# Altium schematic sheet CANDLE-01.SchDoc
size 297 x 209 mm; SheetNumber: 1; SheetTotal: 3
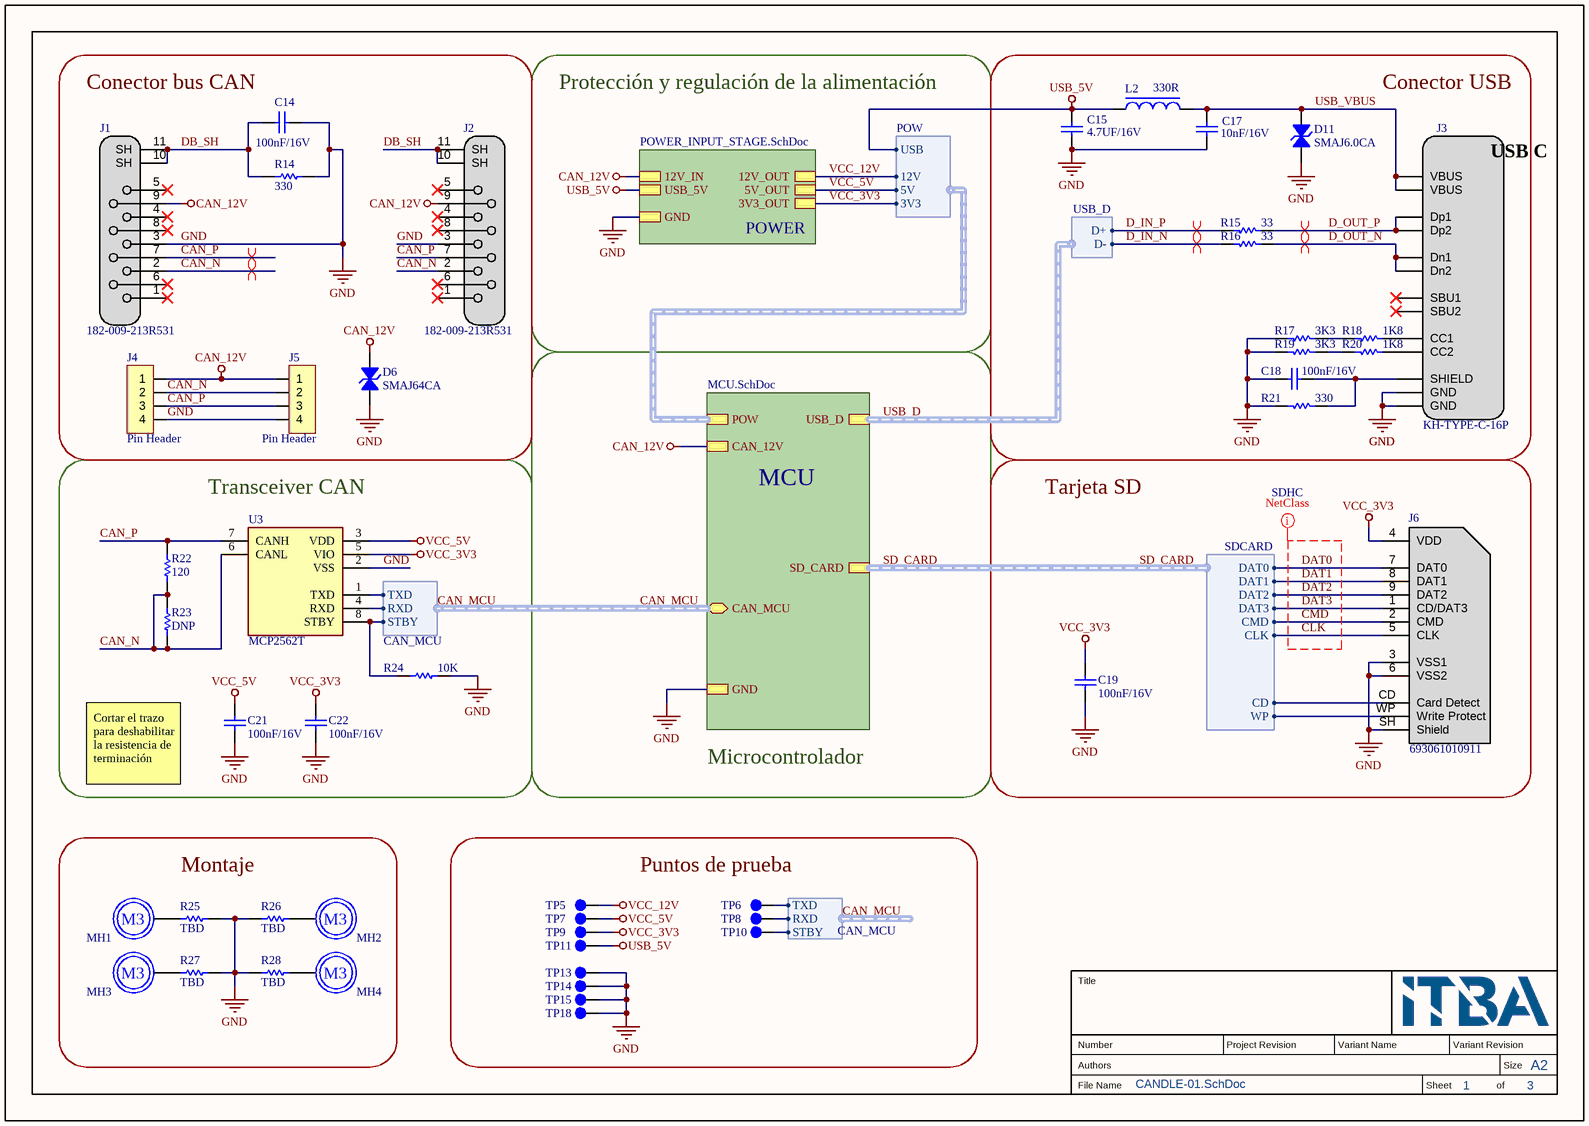
[diagram p0: CANDLE-01.SchDoc]

## Parts
C14  100nF/16V  [CAP0805]
C15  4.7UF/16V  [CAP0805]
C17  10nF/16V  [CAP0805]
C18  100nF/16V  [CAP0805]
C19  100nF/16V  [CAP0805]
C21  100nF/16V  [CAP0805]
C22  100nF/16V  [CAP0805]
D6  SMAJ64CA  [DO-214AC]
D11  SMAJ6.0CA  [DO-214AC]
J1  182-009-213R531  [DE-9 - Female]
J2  182-009-213R531  [DE-9 - Female]
J3  KH-TYPE-C-16P  [USB4105-GF-A-060]
J4  Pin Header  [HEADER-4]
J5  Pin Header  [HEADER-4]
J6  693061010911  [SD CARD CONNECTOR]
L2  330R  [RES0805]
MH1  M3 Mount Hole  [M3_MOUNTING_HOLE]  (value not drawn)  (no BOM)
MH2  M3 Mount Hole  [M3_MOUNTING_HOLE]  (value not drawn)  (no BOM)
MH3  M3 Mount Hole  [M3_MOUNTING_HOLE]  (value not drawn)  (no BOM)
MH4  M3 Mount Hole  [M3_MOUNTING_HOLE]  (value not drawn)  (no BOM)
R14  330  [RES0805]
R15  33  [RES0805]
R16  33  [RES0805]
R17  3K3  [RES0805]
R18  1K8  [RES0805]
R19  3K3  [RES0805]
R20  1K8  [RES0805]
R21  330  [RES0805]
R22  120  [RES0805]
R23  DNP  [RES0805]  (no BOM)
R24  10K  [RES0805]
R25  TBD  [RES0805]
R26  TBD  [RES0805]
R27  TBD  [RES0805]
R28  TBD  [RES0805]
TP5  Testpoint  [TP_SMD_Ø1.0mm]  (value not drawn)  (no BOM)
TP6  Testpoint  [TP_SMD_Ø1.0mm]  (value not drawn)  (no BOM)
TP7  Testpoint  [TP_SMD_Ø1.0mm]  (value not drawn)  (no BOM)
TP8  Testpoint  [TP_SMD_Ø1.0mm]  (value not drawn)  (no BOM)
TP9  Testpoint  [TP_SMD_Ø1.0mm]  (value not drawn)  (no BOM)
TP10  Testpoint  [TP_SMD_Ø1.0mm]  (value not drawn)  (no BOM)
TP11  Testpoint  [TP_SMD_Ø1.0mm]  (value not drawn)  (no BOM)
TP13  Testpoint  [TP_SMD_Ø1.0mm]  (value not drawn)  (no BOM)
TP14  Testpoint  [TP_SMD_Ø1.0mm]  (value not drawn)  (no BOM)
TP15  Testpoint  [TP_SMD_Ø1.0mm]  (value not drawn)  (no BOM)
TP18  Testpoint  [TP_SMD_Ø1.0mm]  (value not drawn)  (no BOM)
U3  MCP2562T  [8-SOIC]

## Blocks framed on the sheet
Conector bus CAN: C14 D6 J1 J2 J4 J5 R14
Conector USB: C15 C17 C18 D11 J3 L2 R15-R21
Transceiver CAN: C21 C22 R22-R24 U3
Tarjeta SD: C19 J6
Montaje: MH1-MH4 R25-R28
Puntos de prueba: TP5-TP11 TP13-TP15 TP18

## Sub-sheets
MCU = MCU.SchDoc: USB_D (harness USB_D), SD_CARD (harness SDCARD), CAN_MCU (bidir, harness CAN_MCU), POW (harness POW), CAN_12V, GND
POWER = POWER_INPUT_STAGE.SchDoc: 12V_IN, GND, 12V_OUT, 5V_OUT, 3V3_OUT, USB_5V

## Harnesses
SDCARD: DAT0, DAT1, DAT2, DAT3, CMD, CLK, CD, WP
CAN_MCU: TXD, RXD, STBY
USB_D: D+, D-
POW: 12V, 5V, 3V3, USB

## Nets
CAN_12V: D6.2(A2) J1.9 J2.9 J4.1 J5.1 ; sheet POWER/12V_IN, sheet MCU/CAN_12V
GND: C14.2 C15.1 C17.1 C18.2 C19.1 C21.1 C22.1 D6.1(A1) D11.1(A1) J1.3 J2.3 J3.A1B12(GND) J3.B1A12(GND) J4.4 J5.4 J6.3(VSS1) J6.6(VSS2) J6.SH(Shield) R14.2 R17.1 R19.1 R21.2 R24.1 R25.1 R26.2 R27.1 R28.2 TP13.1(TP) TP14.1(TP) TP15.1(TP) TP18.1(TP) U3.2(VSS) ; sheet POWER/GND, sheet MCU/GND
USB_5V: C15.2 L2.1 TP11.1(TP) ; sheet POWER/USB_5V, sheet MCU/POW.USB
VCC_3V3: C19.2 C22.2 J6.4(VDD) TP9.1(TP) U3.5(VIO) ; sheet POWER/3V3_OUT, sheet MCU/POW.3V3
VCC_5V: C21.2 TP7.1(TP) U3.3(VDD) ; sheet POWER/5V_OUT, sheet MCU/POW.5V
VCC_12V: TP5.1(TP) ; sheet POWER/12V_OUT, sheet MCU/POW.12V
CAN_MCU.RXD: TP8.1(TP) U3.4(RXD) ; sheet MCU/CAN_MCU.RXD
CAN_MCU.STBY: R24.2 TP10.1(TP) U3.8(STBY) ; sheet MCU/CAN_MCU.STBY
CAN_MCU.TXD: TP6.1(TP) U3.1(TXD) ; sheet MCU/CAN_MCU.TXD
CAN_N: J1.2 J2.2 J4.2 J5.2 R22.1 R23.1 R23.2 U3.6(CANL)
CAN_P: J1.7 J2.7 J4.3 J5.3 R22.2 U3.7(CANH)
CLK: J6.5(CLK) ; sheet MCU/SD_CARD.CLK
CMD: J6.2(CMD) ; sheet MCU/SD_CARD.CMD
D_IN_N: R16.1 ; sheet MCU/USB_D.D-
D_IN_P: R15.1 ; sheet MCU/USB_D.D+
D_OUT_N: J3.A7(Dn1) J3.B7(Dn2) R16.2
D_OUT_P: J3.A6(Dp1) J3.B6(Dp2) R15.2
DAT0: J6.7(DAT0) ; sheet MCU/SD_CARD.DAT0
DAT1: J6.8(DAT1) ; sheet MCU/SD_CARD.DAT1
DAT2: J6.9(DAT2) ; sheet MCU/SD_CARD.DAT2
DAT3: J6.1(CD/DAT3) ; sheet MCU/SD_CARD.DAT3
DB_SH: C14.1 J1.10(SH) J1.11(SH) J2.10(SH) J2.11(SH) R14.1
SD_CARD.CD: J6.CD(Card_Detect) ; sheet MCU/SD_CARD.CD
SD_CARD.WP: J6.WP(Write_Protect) ; sheet MCU/SD_CARD.WP
USB_VBUS: C17.2 D11.2(A2) J3.A4B9(VBUS) J3.B4A9(VBUS) L2.2
NetC18_1: C18.1 J3.SH(SHIELD) R21.1
NetJ3_A5: J3.A5(CC1) R18.2
NetJ3_B5: J3.B5(CC2) R20.2
NetMH1_1: MH1.1(TP) R25.2
NetMH2_1: MH2.1(TP) R26.1
NetMH3_1: MH3.1(TP) R27.2
NetMH4_1: MH4.1(TP) R28.1
NetR17_2: R17.2 R18.1
NetR19_2: R19.2 R20.1

Not connected (* = marked no-connect by the designer): J1 1* 4* 5* 6* 8*; J2 1* 4* 5* 6* 8*; J3 A8(SBU1)* B8(SBU2)*

## Buses and harness runs
harness CAN_MCU = sheet MCU/CAN_MCU
harness SD_CARD = sheet MCU/SD_CARD
harness USB_D = sheet MCU/USB_D

## Layout directives
differential pair; differential pair class CAN: CAN_N, CAN_P
differential pair; differential pair class USB: D_IN_N, D_IN_P, D_OUT_N, D_OUT_P
net class SDHC: CLK, CMD, DAT0, DAT1, DAT2, DAT3

## Notes on the sheet
- Protección y regulación de la alimentación
- Cortar el trazo para deshabilitar la resistencia de terminación
- Microcontrolador
- Title
- File Name
- Number
- Authors
- Project Revision
- Variant Name
- Sheet
- Variant Revision
- of
- Size
- A2
- (in symbol M3 Mount Hole) M3
- (in symbol USB4105-GF-A-060) USB C

## Library data of the parts
C14 C15 C17-C19 C21 C22 = Capacitor: SMD 0805 Capacitor
D6 D11 = Diode TVS: TVS Diode
J1 J2 = DE-09: Receptacle Assembly, 9 Position, Right Angle
J3 = USB4105-GF-A-060: USB Connector Type C SMT 12 Pin; Manufacturer: GCT; Manufacturer Part Number: USB4105-GF-A-060; Distributor Link: https://eu.mouser.com/ProductDetail/GCT/USB4105-GF-A-060?qs=QNEnbhJQKvY2mocwNJzgfA%3D%3D
J4 J5 = HEADER-4: Pin Header 4-pos
J6 = SD_CARD_READER: SD Card Reader
L2 = Ferrite Bead
MH1-MH4 = M3 Mount Hole: M3 Mounting Hole
R14-R28 = Resistor: SMD 0805 Resistor
U3 = MCP2562T: High-Speed CAN Transceiver